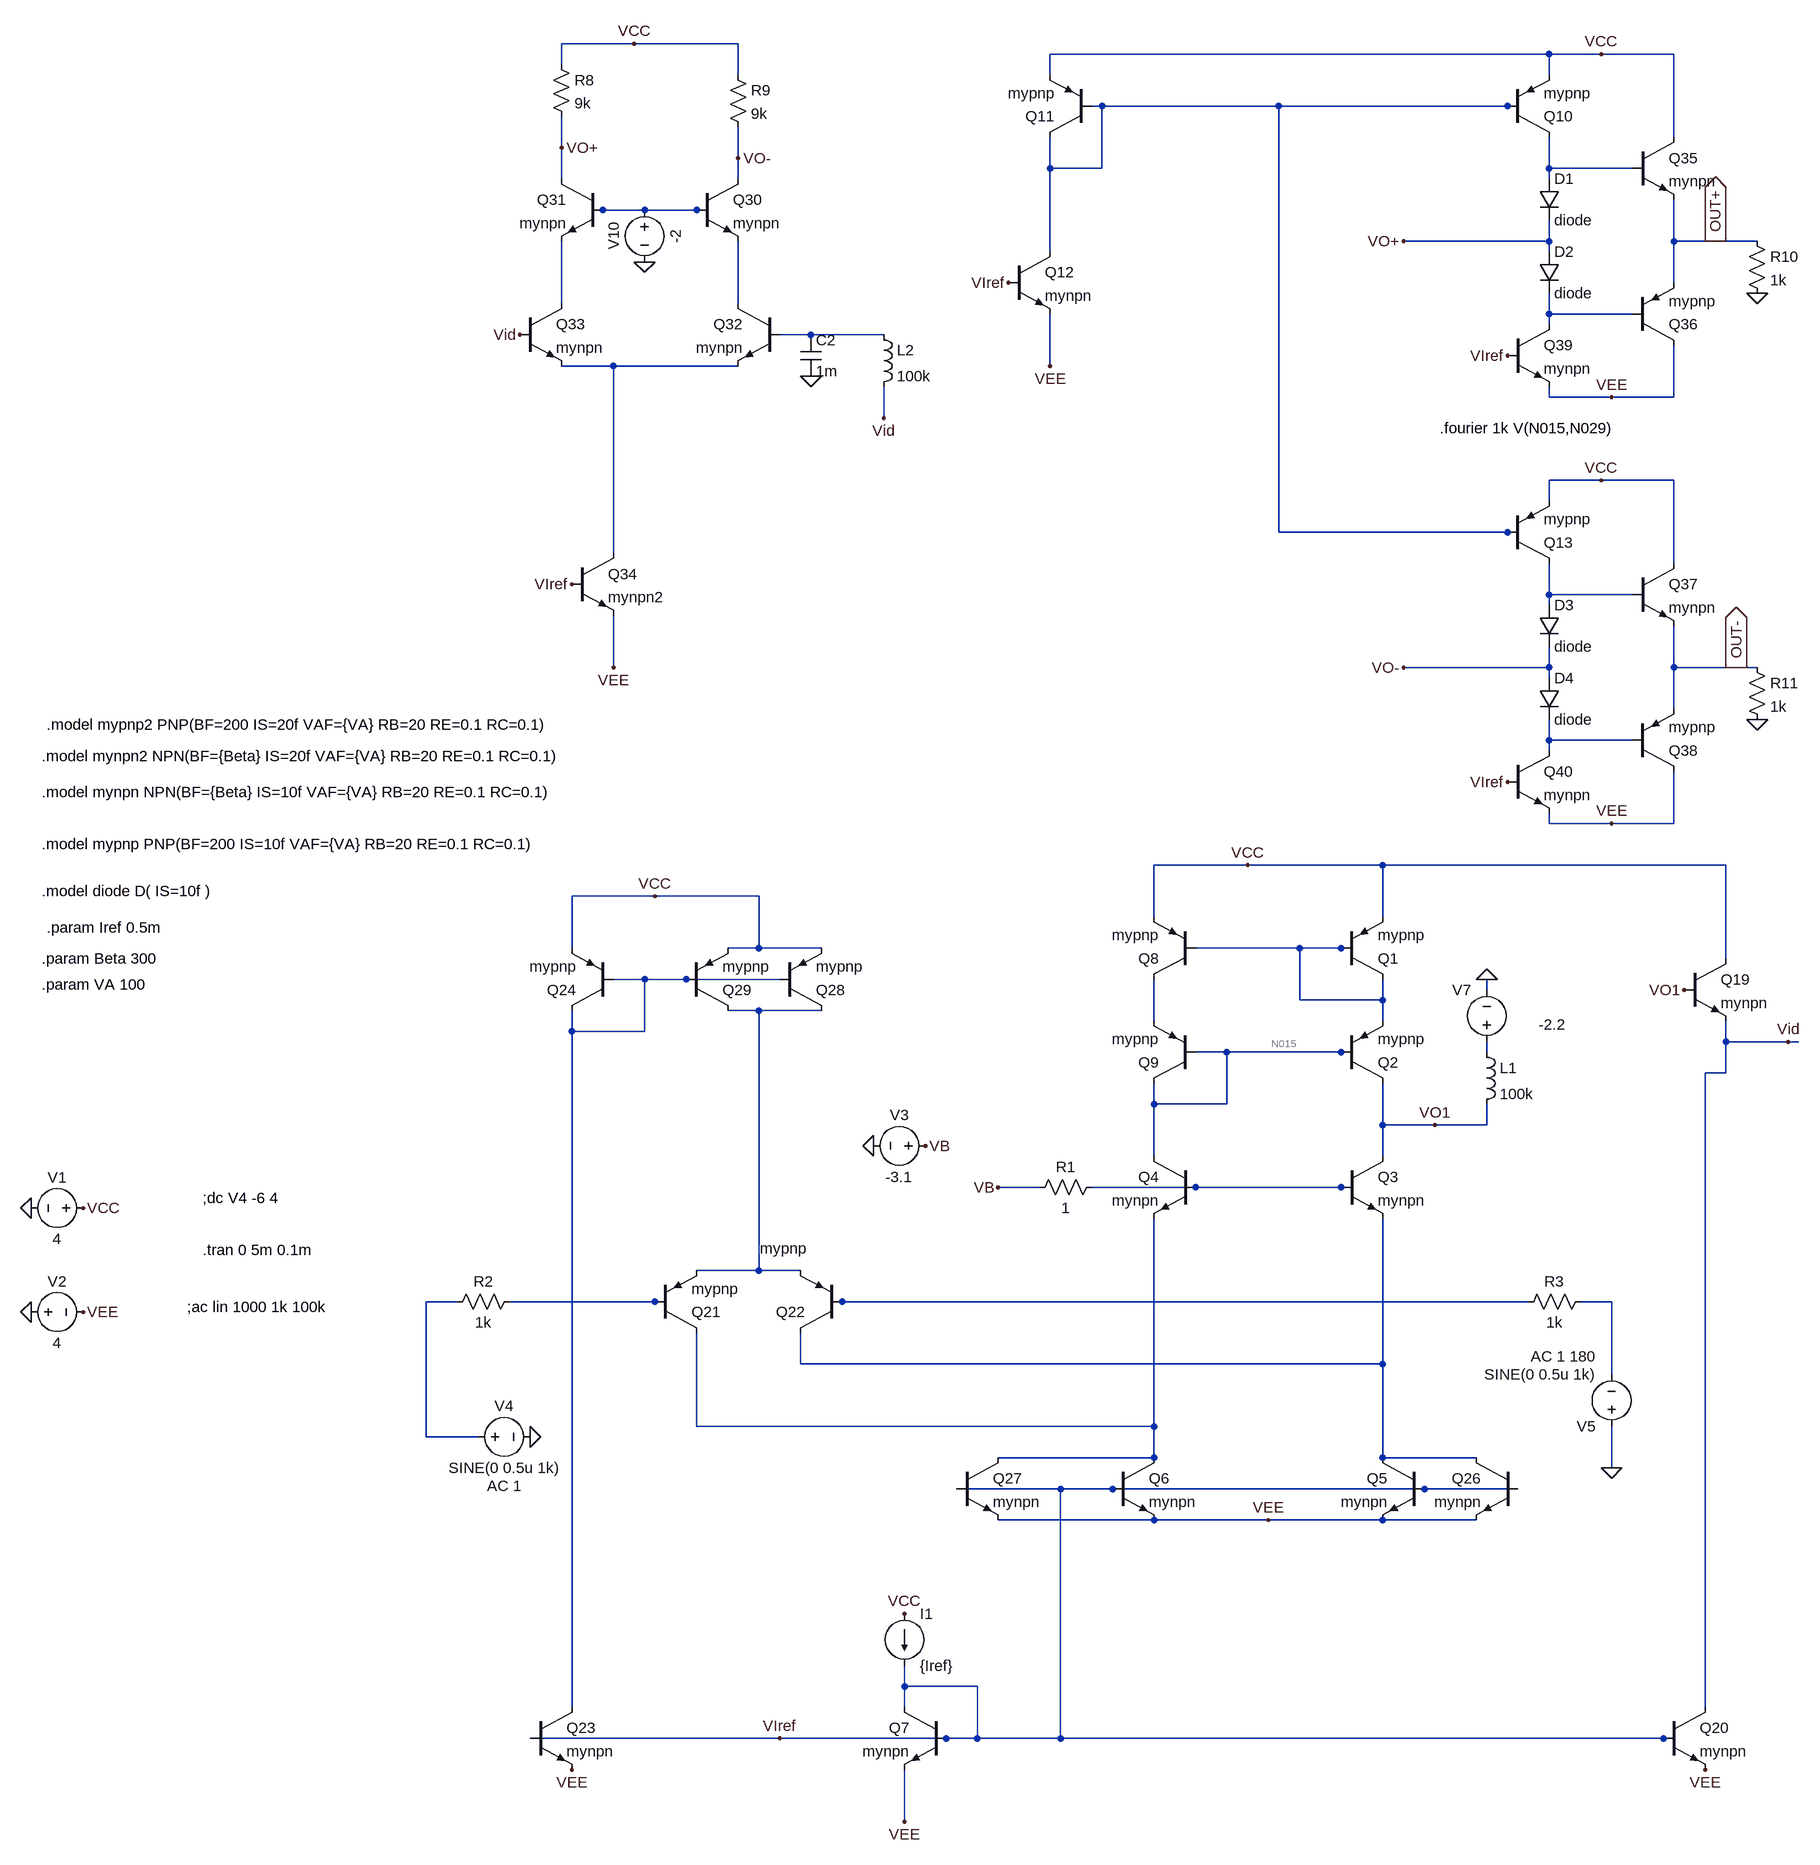
[diagram p0: schematic Project_Phase1_400107553_400100616.asc]
Project_Phase1_400107553_400100616.asc, the LTspice schematic file:
Version 4
SHEET 1 3716 2616
WIRE -1904 -1888 -2016 -1888
WIRE -1744 -1888 -1904 -1888
WIRE -496 -1872 -1264 -1872
WIRE -416 -1872 -496 -1872
WIRE -304 -1872 -416 -1872
WIRE -2016 -1856 -2016 -1888
WIRE -1744 -1840 -1744 -1888
WIRE -1264 -1840 -1264 -1872
WIRE -496 -1840 -496 -1872
WIRE -1184 -1792 -1200 -1792
WIRE -912 -1792 -1184 -1792
WIRE -560 -1792 -912 -1792
WIRE -544 -1792 -560 -1792
WIRE -304 -1744 -304 -1872
WIRE -2016 -1728 -2016 -1776
WIRE -1744 -1712 -1744 -1760
WIRE -1264 -1696 -1264 -1744
WIRE -1184 -1696 -1184 -1792
WIRE -1184 -1696 -1264 -1696
WIRE -496 -1696 -496 -1744
WIRE -368 -1696 -496 -1696
WIRE -2016 -1680 -2016 -1728
WIRE -1744 -1680 -1744 -1712
WIRE -496 -1680 -496 -1696
WIRE -1952 -1632 -1968 -1632
WIRE -1888 -1632 -1952 -1632
WIRE -1808 -1632 -1888 -1632
WIRE -1792 -1632 -1808 -1632
WIRE -496 -1584 -496 -1616
WIRE -496 -1584 -720 -1584
WIRE -304 -1584 -304 -1648
WIRE -240 -1584 -304 -1584
WIRE -176 -1584 -240 -1584
WIRE -1264 -1568 -1264 -1696
WIRE -496 -1568 -496 -1584
WIRE -304 -1520 -304 -1584
WIRE -2016 -1488 -2016 -1584
WIRE -1744 -1488 -1744 -1584
WIRE -496 -1472 -496 -1504
WIRE -368 -1472 -496 -1472
WIRE -496 -1456 -496 -1472
WIRE -1632 -1440 -1680 -1440
WIRE -1520 -1440 -1632 -1440
WIRE -1936 -1392 -2016 -1392
WIRE -1744 -1392 -1936 -1392
WIRE -1264 -1392 -1264 -1472
WIRE -496 -1344 -496 -1360
WIRE -400 -1344 -496 -1344
WIRE -304 -1344 -304 -1424
WIRE -304 -1344 -400 -1344
WIRE -1520 -1312 -1520 -1360
WIRE -416 -1216 -496 -1216
WIRE -304 -1216 -416 -1216
WIRE -496 -1184 -496 -1216
WIRE -912 -1136 -912 -1792
WIRE -560 -1136 -912 -1136
WIRE -544 -1136 -560 -1136
WIRE -1936 -1104 -1936 -1392
WIRE -304 -1088 -304 -1216
WIRE -496 -1040 -496 -1088
WIRE -368 -1040 -496 -1040
WIRE -496 -1024 -496 -1040
WIRE -1936 -928 -1936 -1008
WIRE -496 -928 -496 -960
WIRE -496 -928 -720 -928
WIRE -304 -928 -304 -992
WIRE -208 -928 -304 -928
WIRE -176 -928 -208 -928
WIRE -496 -912 -496 -928
WIRE -304 -864 -304 -928
WIRE -496 -816 -496 -848
WIRE -368 -816 -496 -816
WIRE -496 -800 -496 -816
WIRE -496 -688 -496 -704
WIRE -400 -688 -496 -688
WIRE -304 -688 -304 -768
WIRE -304 -688 -400 -688
WIRE -960 -624 -1104 -624
WIRE -752 -624 -960 -624
WIRE -224 -624 -752 -624
WIRE -1872 -576 -2000 -576
WIRE -1712 -576 -1872 -576
WIRE -1104 -544 -1104 -624
WIRE -752 -544 -752 -624
WIRE -2000 -496 -2000 -576
WIRE -1712 -496 -1712 -576
WIRE -1712 -496 -1760 -496
WIRE -1616 -496 -1712 -496
WIRE -880 -496 -1040 -496
WIRE -816 -496 -880 -496
WIRE -800 -496 -816 -496
WIRE -224 -480 -224 -624
WIRE -1888 -448 -1936 -448
WIRE -1824 -448 -1888 -448
WIRE -1680 -448 -1824 -448
WIRE -592 -432 -592 -448
WIRE -272 -432 -288 -432
WIRE -880 -416 -880 -496
WIRE -752 -416 -752 -448
WIRE -752 -416 -880 -416
WIRE -1712 -400 -1760 -400
WIRE -1616 -400 -1712 -400
WIRE -1104 -384 -1104 -448
WIRE -752 -384 -752 -416
WIRE -2000 -368 -2000 -400
WIRE -1888 -368 -1888 -448
WIRE -1888 -368 -2000 -368
WIRE -224 -352 -224 -384
WIRE -128 -352 -224 -352
WIRE -112 -352 -128 -352
WIRE -992 -336 -1040 -336
WIRE -816 -336 -992 -336
WIRE -800 -336 -816 -336
WIRE -592 -336 -592 -352
WIRE -224 -304 -224 -352
WIRE -224 -304 -256 -304
WIRE -1104 -256 -1104 -288
WIRE -992 -256 -992 -336
WIRE -992 -256 -1104 -256
WIRE -752 -224 -752 -288
WIRE -672 -224 -752 -224
WIRE -592 -224 -592 -256
WIRE -592 -224 -672 -224
WIRE -1104 -176 -1104 -256
WIRE -752 -176 -752 -224
WIRE -1280 -128 -1344 -128
WIRE -1040 -128 -1200 -128
WIRE -816 -128 -1040 -128
WIRE -800 -128 -816 -128
WIRE -1712 0 -1712 -400
WIRE -1712 0 -1808 0
WIRE -1648 0 -1712 0
WIRE -2176 48 -2224 48
WIRE -1872 48 -2096 48
WIRE -1856 48 -1872 48
WIRE -1584 48 -1600 48
WIRE -528 48 -1584 48
WIRE -400 48 -448 48
WIRE -1648 144 -1648 96
WIRE -752 144 -752 -80
WIRE -752 144 -1648 144
WIRE -400 160 -400 48
WIRE -1808 240 -1808 96
WIRE -1104 240 -1104 -80
WIRE -1104 240 -1808 240
WIRE -2224 256 -2224 48
WIRE -2144 256 -2224 256
WIRE -1104 288 -1104 240
WIRE -1104 288 -1344 288
WIRE -752 288 -752 144
WIRE -608 288 -752 288
WIRE -400 304 -400 240
WIRE -1248 336 -1408 336
WIRE -1168 336 -1248 336
WIRE -688 336 -1168 336
WIRE -544 336 -688 336
WIRE -1104 384 -1344 384
WIRE -928 384 -1104 384
WIRE -752 384 -928 384
WIRE -608 384 -752 384
WIRE -1488 640 -1488 608
WIRE -1376 640 -1488 640
WIRE -2000 672 -2000 -368
WIRE -1488 672 -1488 640
WIRE -256 672 -256 -304
WIRE -1680 720 -2064 720
WIRE -1424 720 -1680 720
WIRE -1376 720 -1376 640
WIRE -1376 720 -1424 720
WIRE -1248 720 -1248 336
WIRE -1248 720 -1376 720
WIRE -320 720 -1248 720
WIRE -304 720 -320 720
WIRE -1488 848 -1488 768
FLAG -2832 -96 0
FLAG -2832 64 0
FLAG -2752 -96 VCC
FLAG -960 -624 VCC
FLAG -2752 64 VEE
FLAG -1536 -192 0
FLAG -1456 -192 VB
FLAG -400 304 0
FLAG -1488 848 VEE
FLAG -1488 528 VCC
FLAG -1344 -128 VB
FLAG -2064 256 0
FLAG -592 -448 0
FLAG -672 -224 VO1
FLAG -256 768 VEE
FLAG -288 -432 VO1
FLAG -128 -352 Vid
FLAG -2000 768 VEE
FLAG -1872 -576 VCC
FLAG -928 384 VEE
FLAG -1936 -928 VEE
FLAG -2000 -1056 VIref
FLAG -1904 -1888 VCC
FLAG -2016 -1728 VO+
FLAG -1744 -1712 VO-
FLAG -1888 -1552 0
FLAG -2080 -1440 Vid
FLAG -176 -1504 0
FLAG -416 -1872 VCC
FLAG -400 -1344 VEE
FLAG -176 -848 0
FLAG -416 -1216 VCC
FLAG -400 -688 VEE
FLAG -1632 -1376 0
FLAG -1520 -1312 Vid
FLAG -560 -1408 VIref
FLAG -560 -752 VIref
FLAG -1680 720 VIref
FLAG -720 -1584 VO+
FLAG -720 -928 VO-
FLAG -1264 -1392 VEE
FLAG -1328 -1520 VIref
FLAG -240 -1584 OUT+
IOPIN -240 -1584 Out
FLAG -208 -928 OUT-
IOPIN -208 -928 Out
SYMBOL voltage -2736 -96 R90
WINDOW 0 -32 56 VBottom 2
WINDOW 3 32 56 VTop 2
WINDOW 123 0 0 Left 0
WINDOW 39 0 0 Left 0
SYMATTR InstName V1
SYMATTR Value 4
SYMBOL voltage -2848 64 R270
WINDOW 0 32 56 VTop 2
WINDOW 3 -32 56 VBottom 2
WINDOW 123 0 0 Left 0
WINDOW 39 0 0 Left 0
SYMATTR InstName V2
SYMATTR Value 4
SYMBOL pnp -816 -448 M180
SYMATTR InstName Q1
SYMATTR Value mypnp
SYMBOL pnp -816 -288 M180
SYMATTR InstName Q2
SYMATTR Value mypnp
SYMBOL npn -816 -176 R0
SYMATTR InstName Q3
SYMATTR Value mynpn
SYMBOL npn -1040 -176 M0
SYMATTR InstName Q4
SYMATTR Value mynpn
SYMBOL npn -688 288 M0
SYMATTR InstName Q5
SYMATTR Value mynpn
SYMBOL npn -1168 288 R0
SYMATTR InstName Q6
SYMATTR Value mynpn
SYMBOL voltage -1440 -192 R90
WINDOW 0 -32 56 VBottom 2
WINDOW 3 32 56 VTop 2
WINDOW 123 0 0 Left 0
WINDOW 39 0 0 Left 0
SYMATTR InstName V3
SYMATTR Value -3.1
SYMBOL voltage -2160 256 R270
WINDOW 0 32 56 VTop 2
WINDOW 3 -32 56 VBottom 2
WINDOW 123 -60 56 VBottom 2
WINDOW 39 0 0 Left 0
SYMATTR InstName V4
SYMATTR Value SINE(0 0.5u 1k)
SYMATTR Value2 AC 1
SYMBOL voltage -400 256 R180
WINDOW 123 24 124 Left 2
WINDOW 39 0 0 Left 0
SYMATTR Value2 AC 1 180
SYMATTR InstName V5
SYMATTR Value SINE(0 0.5u 1k)
SYMBOL npn -1424 672 M0
SYMATTR InstName Q7
SYMATTR Value mynpn
SYMBOL pnp -1040 -448 R180
SYMATTR InstName Q8
SYMATTR Value mypnp
SYMBOL pnp -1040 -288 R180
SYMATTR InstName Q9
SYMATTR Value mypnp
SYMBOL current -1488 528 R0
SYMATTR InstName I1
SYMATTR Value {Iref}
SYMBOL res -1184 -144 R90
WINDOW 0 0 56 VBottom 2
WINDOW 3 32 56 VTop 2
SYMATTR InstName R1
SYMATTR Value 1
SYMBOL res -2080 32 R90
WINDOW 0 0 56 VBottom 2
WINDOW 3 32 56 VTop 2
SYMATTR InstName R2
SYMATTR Value 1k
SYMBOL res -432 32 R90
WINDOW 0 0 56 VBottom 2
WINDOW 3 32 56 VTop 2
SYMATTR InstName R3
SYMATTR Value 1k
SYMBOL ind -608 -352 R0
SYMATTR InstName L1
SYMATTR Value 100k
SYMBOL voltage -592 -336 R180
WINDOW 0 24 96 Left 2
WINDOW 3 -122 43 Left 2
WINDOW 123 0 0 Left 0
WINDOW 39 0 0 Left 0
SYMATTR InstName V7
SYMATTR Value -2.2
SYMBOL npn -288 -480 R0
SYMATTR InstName Q19
SYMATTR Value mynpn
SYMBOL npn -320 672 R0
SYMATTR InstName Q20
SYMATTR Value mynpn
SYMBOL pnp -1872 96 M180
SYMATTR InstName Q21
SYMATTR Value mypnp
SYMBOL pnp -1584 96 R180
WINDOW 3 54 130 Left 2
SYMATTR Value mypnp
SYMATTR InstName Q22
SYMBOL npn -2064 672 R0
SYMATTR InstName Q23
SYMATTR Value mynpn
SYMBOL pnp -1936 -400 R180
SYMATTR InstName Q24
SYMATTR Value mypnp
SYMBOL npn -544 288 M0
SYMATTR InstName Q26
SYMATTR Value mynpn
SYMBOL npn -1408 288 R0
SYMATTR InstName Q27
SYMATTR Value mynpn
SYMBOL pnp -1680 -400 M180
SYMATTR InstName Q28
SYMATTR Value mypnp
SYMBOL pnp -1824 -400 M180
SYMATTR InstName Q29
SYMATTR Value mypnp
SYMBOL npn -1808 -1680 R0
SYMATTR InstName Q30
SYMATTR Value mynpn
SYMBOL npn -1952 -1680 M0
SYMATTR InstName Q31
SYMATTR Value mynpn
SYMBOL npn -1680 -1488 M0
SYMATTR InstName Q32
SYMATTR Value mynpn
SYMBOL npn -2080 -1488 R0
SYMATTR InstName Q33
SYMATTR Value mynpn
SYMBOL npn -2000 -1104 R0
SYMATTR InstName Q34
SYMATTR Value mynpn2
SYMBOL res -2032 -1872 R0
SYMATTR InstName R8
SYMATTR Value 9k
SYMBOL res -1760 -1856 R0
SYMATTR InstName R9
SYMATTR Value 9k
SYMBOL voltage -1888 -1648 R0
WINDOW 0 -32 56 VBottom 2
WINDOW 3 32 56 VTop 2
WINDOW 123 0 0 Left 0
WINDOW 39 0 0 Left 0
SYMATTR InstName V10
SYMATTR Value -2
SYMBOL npn -368 -1744 R0
SYMATTR InstName Q35
SYMATTR Value mynpn
SYMBOL pnp -368 -1424 M180
SYMATTR InstName Q36
SYMATTR Value mypnp
SYMBOL diode -512 -1680 R0
SYMATTR InstName D1
SYMATTR Value diode
SYMBOL diode -512 -1568 R0
SYMATTR InstName D2
SYMATTR Value diode
SYMBOL res -192 -1600 R0
SYMATTR InstName R10
SYMATTR Value 1k
SYMBOL npn -368 -1088 R0
SYMATTR InstName Q37
SYMATTR Value mynpn
SYMBOL pnp -368 -768 M180
SYMATTR InstName Q38
SYMATTR Value mypnp
SYMBOL diode -512 -1024 R0
SYMATTR InstName D3
SYMATTR Value diode
SYMBOL diode -512 -912 R0
SYMATTR InstName D4
SYMATTR Value diode
SYMBOL res -192 -944 R0
SYMATTR InstName R11
SYMATTR Value 1k
SYMBOL cap -1648 -1440 R0
SYMATTR InstName C2
SYMATTR Value 1m
SYMBOL ind -1536 -1456 R0
SYMATTR InstName L2
SYMATTR Value 100k
SYMBOL npn -560 -1456 R0
SYMATTR InstName Q39
SYMATTR Value mynpn
SYMBOL npn -560 -800 R0
SYMATTR InstName Q40
SYMATTR Value mynpn
SYMBOL pnp -560 -1744 M180
SYMATTR InstName Q10
SYMATTR Value mypnp
SYMBOL pnp -1200 -1744 R180
SYMATTR InstName Q11
SYMATTR Value mypnp
SYMBOL npn -1328 -1568 R0
SYMATTR InstName Q12
SYMATTR Value mynpn
SYMBOL pnp -560 -1088 M180
SYMATTR InstName Q13
SYMATTR Value mypnp
TEXT -2816 -736 Left 2 !.model mynpn NPN(BF={Beta} IS=10f VAF={VA} RB=20 RE=0.1 RC=0.1)
TEXT -2816 -656 Left 2 !.model mypnp PNP(BF=200 IS=10f VAF={VA} RB=20 RE=0.1 RC=0.1)
TEXT -2816 -584 Left 2 !.model diode D( IS=10f )
TEXT -2592 56 Left 2 !;ac lin 1000 1k 100k
TEXT -2568 -32 Left 2 !.tran 0 5m 0.1m
TEXT -2808 -528 Left 2 !.param Iref 0.5m
TEXT -2816 -792 Left 2 !.model mynpn2 NPN(BF={Beta} IS=20f VAF={VA} RB=20 RE=0.1 RC=0.1)
TEXT -2816 -480 Left 2 !.param Beta 300
TEXT -2816 -440 Left 2 !.param VA 100
TEXT -2808 -840 Left 2 !.model mypnp2 PNP(BF=200 IS=20f VAF={VA} RB=20 RE=0.1 RC=0.1)
TEXT -2568 -112 Left 2 !;dc V4 -6 4
TEXT -664 -1296 Left 2 !.fourier 1k V(N015,N029)

The netlist it stands for:
* Project_Phase1_400107553_400100616.asc
V1 VCC 0 4
V2 0 VEE 4
Q1 N011 N011 VCC 0 mypnp
Q2 VO1 N015 N011 0 mypnp
Q3 VO1 N017 N022 0 mynpn
Q4 N015 N017 N023 0 mynpn
Q5 N022 VIref VEE 0 mynpn
Q6 N023 VIref VEE 0 mynpn
V3 VB 0 -3.1
V4 N018 0 SINE(0 0.5u 1k) AC 1
V5 0 N021 SINE(0 0.5u 1k) AC 1 180
Q7 VIref VIref VEE 0 mynpn
Q8 N014 N011 VCC 0 mypnp
Q9 N015 N015 N014 0 mypnp
I1 VCC VIref {Iref}
R1 N017 VB 1
R2 N019 N018 1k
R3 N021 N020 1k
L1 N016 VO1 100k
V7 N016 0 -2.2
Q19 VCC VO1 Vid 0 mynpn
Q20 Vid VIref VEE 0 mynpn
Q21 N023 N019 N013 0 mypnp
Q22 N022 N020 N013 0 mypnp
Q23 N012 VIref VEE 0 mynpn
Q24 N012 N012 VCC 0 mypnp
Q26 N022 VIref VEE 0 mynpn
Q27 N023 VIref VEE 0 mynpn
Q28 N013 N012 VCC 0 mypnp
Q29 N013 N012 VCC 0 mypnp
Q30 VO- N003 N005 0 mynpn
Q31 VO+ N003 N004 0 mynpn
Q32 N005 N007 N008 0 mynpn
Q33 N004 Vid N008 0 mynpn
Q34 N008 VIref VEE 0 mynpn2
R8 VCC VO+ 9k
R9 VCC VO- 9k
V10 N003 0 -2
Q35 VCC N002 OUT+ 0 mynpn
Q36 VEE N006 OUT+ 0 mypnp
D1 N002 VO+ diode
D2 VO+ N006 diode
R10 OUT+ 0 1k
Q37 VCC N009 OUT- 0 mynpn
Q38 VEE N010 OUT- 0 mypnp
D3 N009 VO- diode
D4 VO- N010 diode
R11 OUT- 0 1k
C2 N007 0 1m
L2 N007 Vid 100k
Q39 N006 VIref VEE 0 mynpn
Q40 N010 VIref VEE 0 mynpn
Q10 N002 N001 VCC 0 mypnp
Q11 N001 N001 VCC 0 mypnp
Q12 N001 VIref VEE 0 mynpn
Q13 N009 N001 VCC 0 mypnp
.model D D
.lib standard.dio
.model NPN NPN
.model PNP PNP
.lib standard.bjt
.model mynpn NPN(BF={Beta} IS=10f VAF={VA} RB=20 RE=0.1 RC=0.1)
.model mypnp PNP(BF=200 IS=10f VAF={VA} RB=20 RE=0.1 RC=0.1)
.model diode D( IS=10f )
;ac lin 1000 1k 100k
.tran 0 5m 0.1m
.param Iref 0.5m
.model mynpn2 NPN(BF={Beta} IS=20f VAF={VA} RB=20 RE=0.1 RC=0.1)
.param Beta 300
.param VA 100
.model mypnp2 PNP(BF=200 IS=20f VAF={VA} RB=20 RE=0.1 RC=0.1)
;dc V4 -6 4
.fourier 1k V(N015,N029)
.backanno
.end